# Altium schematic sheet CODEC and Headphone Jack.SchDoc
size A4; SheetNumber: 23; SheetTotal: 26
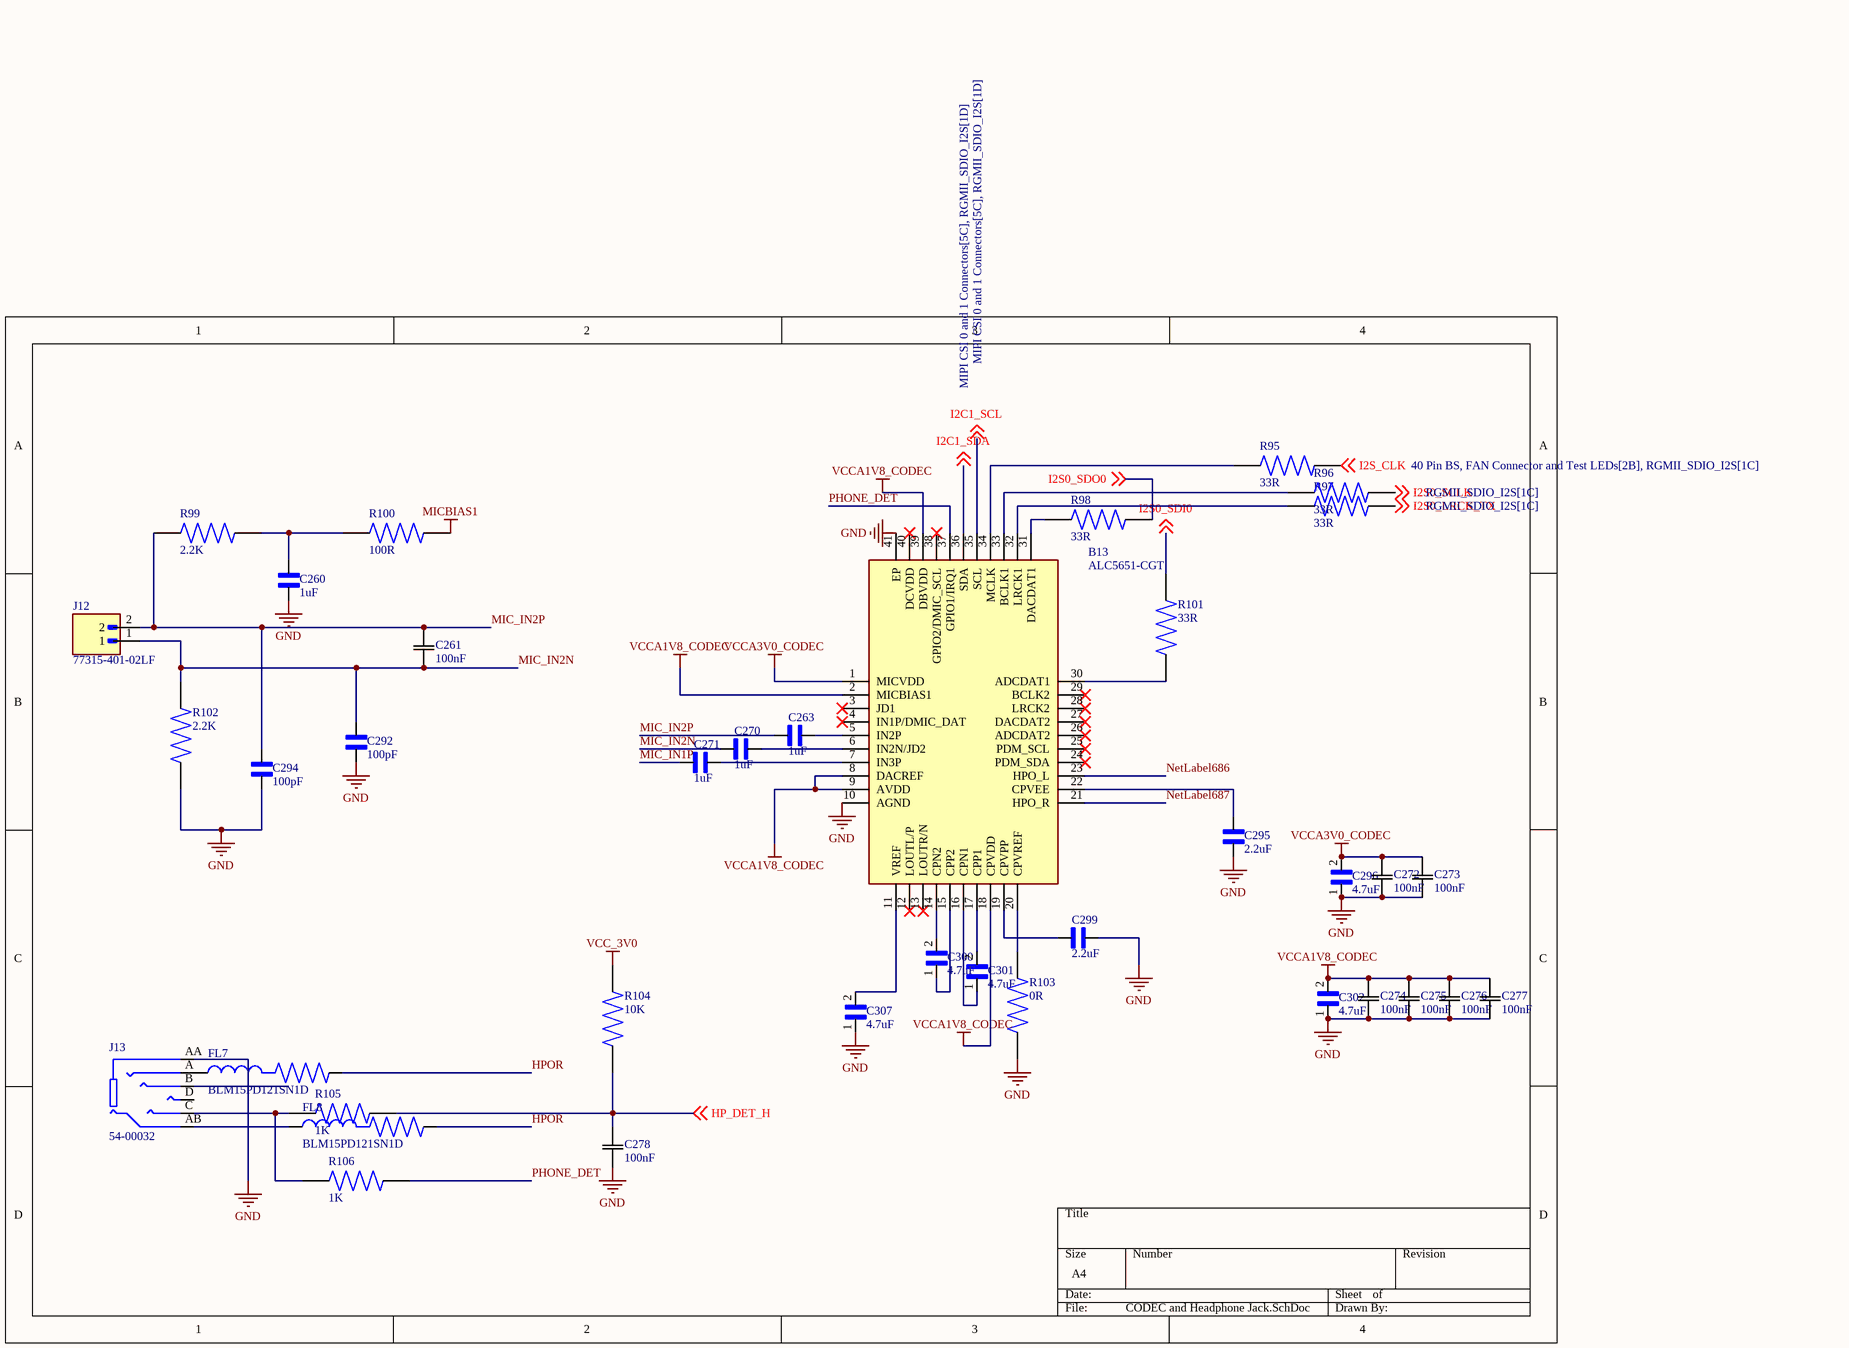
[diagram p0: CODEC and Headphone Jack.SchDoc]

## Parts
B13  ALC5651-CGT  [QFN40P500X500X90-41N-D]
C260  1uF  [CAPC1005X56N]
C261  100nF  [CAP_1005_TDK]
C263  1uF  [CAPC1005X56N]
C270  1uF  [CAPC1005X56N]
C271  1uF  [CAPC1005X56N]
C272  100nF  [CAP_1005_TDK]
C273  100nF  [CAP_1005_TDK]
C274  100nF  [CAP_1005_TDK]
C275  100nF  [CAP_1005_TDK]
C276  100nF  [CAP_1005_TDK]
C277  100nF  [CAP_1005_TDK]
C278  100nF  [CAP_1005_TDK]
C292  100pF  [CAPC2012X140N]
C294  100pF  [CAPC2012X140N]
C295  2.2uF  [CAPC3225X140N]
C296  4.7uF  [CAPC6050X350N]
C299  2.2uF  [CAPC3225X140N]
C300  4.7uF  [CAPC6050X350N]
C301  4.7uF  [CAPC6050X350N]
C302  4.7uF  [CAPC6050X350N]
C307  4.7uF  [CAPC6050X350N]
FL7  BLM15PD121SN1D  [BEADC1005X55N]
FL8  BLM15PD121SN1D  [BEADC1005X55N]
J12  77315-401-02LF  [AMPHENOL_77315-401-02LF]
J13  54-00032  [TENSILITY_54-00032]
R95  33R  [RES_ERA6AHD330V]
R96  33R  [RES_ERA6AHD330V]
R97  33R  [RES_ERA6AHD330V]
R98  33R  [RES_ERA6AHD330V]
R99  2.2K  [RESC1608X50N]
R100  100R  [RES_ERJU14F1000U]
R101  33R  [RES_ERA6AHD330V]
R102  2.2K  [RESC1608X50N]
R103  0R  [RES_ERJH6G0R00V]
R104  10K  [RES_ERA3ARB103V]
R105  1K  [RESC1608X55N]
R106  1K  [RESC1608X55N]

## Nets
GND: B13.10(AGND) B13.41(EP) C260.1 C272.1 C273.1 C274.1 C275.1 C276.1 C277.1 C278.1 C292.2 C294.2 C295.1 C296.1 C299.1 C302.1 C307.1 J13.AA R102.1 R103.1
MICBIAS1: R100.2
VCC_3V0: R104.2
VCCA1V8_CODEC: B13.2(MICBIAS1) B13.8(DACREF) B13.9(AVDD) B13.18(CPVDD) B13.39(DBVDD) C274.2 C275.2 C276.2 C277.2 C302.2
VCCA3V0_CODEC: B13.1(MICVDD) C272.2 C273.2 C296.2
HP_DET_H: C278.2 R104.1 R105.2 ; off-sheet HP_DET_H
HPOR: FL7.2 FL8.2
I2C1_SCL: B13.35(SCL) ; off-sheet I2C1_SCL
I2C1_SDA: B13.36(SDA) ; off-sheet I2C1_SDA
I2S0_LRCK_TX: R97.1 ; off-sheet I2S0_LRCK_TX
I2S0_SCLK: R96.1 ; off-sheet I2S0_SCLK
I2S0_SDI0: R101.2 ; off-sheet I2S0_SDI0
I2S0_SDO0: R98.2 ; off-sheet I2S0_SDO0
I2S_CLK: R95.1 ; off-sheet I2S_CLK
MIC_IN1P: C271.2
MIC_IN2N: C261.1 C270.2 C292.1 J12.1 R102.2
MIC_IN2P: C261.2 C263.2 C294.1 J12.2 R99.1
NetLabel686: B13.23(HPO_L)
NetLabel687: B13.21(HPO_R)
PHONE_DET: B13.37(GPIO1/IRQ1) R106.2
NetB13_5: B13.5(IN2P) C263.1
NetB13_6: B13.6(IN2N/JD2) C270.1
NetB13_7: B13.7(IN3P) C271.1
NetB13_11: B13.11(VREF) C307.2
NetB13_14: B13.14(CPN2) C300.2
NetB13_15: B13.15(CPP2) C300.1
NetB13_16: B13.16(CPN1) C301.1
NetB13_17: B13.17(CPP1) C301.2
NetB13_19: B13.19(CPVPP) C299.2
NetB13_20: B13.20(CPVREF) R103.2
NetB13_22: B13.22(CPVEE) C295.2
NetB13_30: B13.30(ADCDAT1) R101.1
NetB13_31: B13.31(DACDAT1) R98.1
NetB13_32: B13.32(LRCK1) R97.2
NetB13_33: B13.33(BCLK1) R96.2
NetB13_34: B13.34(MCLK) R95.2
NetC260_2: C260.2 R99.2 R100.1
NetFL7_1: FL7.1 J13.A
NetFL8_1: FL8.1 J13.AB
NetJ13_C: J13.C R105.1 R106.1

Not connected (* = marked no-connect by the designer): B13 3(JD1)* 4(IN1P/DMIC_DAT)* 12(LOUTL/P)* 13(LOUTR/N)* 24(PDM_SDA)* 25(PDM_SCL)* 26(ADCDAT2)* 27(DACDAT2)* 28(LRCK2)* 29(BCLK2)* 38(GPIO2/DMIC_SCL)* 40(DCVDD)*; J13 B D

## Library data of the parts
B13 = ALC5651-CGT: high performance, low power, dual I2 S interface audio CODEC Digital-to-Analog Converter with 100dBA SNR; Manufacturer_Name: Realtek; Geometry.Height: 0.9mm; Manufacturer_Part_Number: ALC5651-CGT; Mouser Part Number: *; Mouser Price/Stock: *; Arrow Part Number: *; Arrow Price/Stock: *; Datasheet Link: https://datasheet.lcsc.com/szlcsc/2001151131_Realtek-Semicon-ALC5651-CGT_C474323.pdf
C260 C263 C270 C271 = 0402ZD105KAT4A: 1 ÂµF Â±10% 10V Ceramic Capacitor X5R 0402 (1005 Metric); MF: AVX; SnapEDA_Link: https://www.snapeda.com/parts/0402ZD105KAT4A/AVX/view-part/?ref=snap; Package: 1005 AVX; Value: *; MP: 0402ZD105KAT4A; Check_prices: https://www.snapeda.com/parts/0402ZD105KAT4A/AVX/view-part/?ref=eda
C261 C272-C278 = C1005X7R1H104M050BB: Description; Manufacturer_Name: TDK; Copyright: Copyright (C) 2025 Ultra Librarian. All rights reserved.; Manufacturer_Part_Number: C1005X7R1H104M050BB
C292 C294 = C0805C220J5GACTU: Capacitor, Ceramic, Cap, 22.0pF, Tol 5%, SMT, 50V, C0G | KEMET C0805C220J5GACTU; SnapEDA_Link: https://www.snapeda.com/parts/C0805C220J5GACTU/KEMET/view-part/?ref=snap; Package: 0805 Kemet; Value: *; MF: KEMET; MP: C0805C220J5GACTU; Check_prices: https://www.snapeda.com/parts/C0805C220J5GACTU/KEMET/view-part/?ref=eda
C295 C299 = C1210C105K5RACTU: Capacitor;Ceramic;Cap;1.00uF;Tol+10%;SMT;Vol-Rtg 50V;High Cap.;X7R;TR | KEMET C1210C105K5RACTU; SnapEDA_Link: https://www.snapeda.com/parts/C1210C105K5RACTU/KEMET/view-part/?ref=snap; Package: 1210-2 KEMET; Value: *; MF: KEMET; MP: C1210C105K5RACTU; Check_prices: https://www.snapeda.com/parts/C1210C105K5RACTU/KEMET/view-part/?ref=eda
C296 C300-C302 C307 = CKG57KX7R2A475M335JJ: CAP CER 4.7UF 100V X7R SMD; MF: TDK; Price: None; Purchase-URL: https://pricing.snapeda.com/search/part/CKG57KX7R2A475M335JJ/?ref=eda; SnapEDA_Link: https://www.snapeda.com/parts/CKG57KX7R2A475M335JJ/TDK/view-part/?ref=snap; Availability: In Stock; Value: *; MP: CKG57KX7R2A475M335JJ; Package: 6050 TDK; Check_prices: https://www.snapeda.com/parts/CKG57KX7R2A475M335JJ/TDK/view-part/?ref=eda
FL7 FL8 = BLM15PD121SN1D: 120 Ohms @ 100 MHz 1 Power Line Ferrite Bead 0402 (1005 Metric) 1.3A 90mOhm; MF: Murata; SnapEDA_Link: https://www.snapeda.com/parts/BLM15PD121SN1D/Murata/view-part/?ref=snap; Package: 1005 Taiyo Yuden; Value: *; MP: BLM15PD121SN1D; Check_prices: https://www.snapeda.com/parts/BLM15PD121SN1D/Murata/view-part/?ref=eda
J13 = 54-00032: Connector, 6C audio jack, 3.5xL18.6 mm, PCB mount, 90 degrees, Au plated; MF: Tensility International; SnapEDA_Link: https://www.snapeda.com/parts/54-00032/Tensility+International+Corp/view-part/?ref=snap; Package: None; Value: *; MP: 54-00032; Check_prices: https://www.snapeda.com/parts/54-00032/Tensility+International+Corp/view-part/?ref=eda
R95-R98 R101 = ERA6AHD330V: Package: None; MP: ERA6AHD330V; Price: None; Value: *; Availability: Unavailable
R99 R102 = RR0816P-222-D: RR Series 0603 0.0625 W 2.2 kOhm Â± 0.5% Â±25 ppm/Â°C SMT Metal Film Chip Resistor; MF: Susumu; SnapEDA_Link: https://www.snapeda.com/parts/RR0816P-222-D/Susumu/view-part/?ref=snap; Package: 1608 Susumu; Value: *; MP: RR0816P-222-D; Check_prices: https://www.snapeda.com/parts/RR0816P-222-D/Susumu/view-part/?ref=eda
R100 = ERJU14F1000U: Price: None; Availability: Unavailable; Value: *; MP: ERJU14F1000U; Package: None
R103 = ERJH6G0R00V: MP: ERJH6G0R00V; Value: *; Availability: Unavailable; Price: None; Package: None
R104 = ERA3ARB103V: MP: ERA3ARB103V; Availability: Unavailable; Package: None; Value: *; Price: None
R105 R106 = CRCW06031K00FKECC: 1 kOhms Â±1% 0.1W, 1/10W Chip Resistor 0603 (1608 Metric) - Thick Film; MF: Vishay; SnapEDA_Link: https://www.snapeda.com/parts/CRCW06031K00FKECC/Vishay/view-part/?ref=snap; Package: 0603-2 Vishay; Value: *; MP: CRCW06031K00FKECC; Check_prices: https://www.snapeda.com/parts/CRCW06031K00FKECC/Vishay/view-part/?ref=eda
J12 = 77315-401-02LF: Package: None; Price: None; Value: *; MP: 77315-401-02LF; Availability: Unavailable